# Altium schematic sheet InputBoard_Analog+Digital.SchDoc
size A4
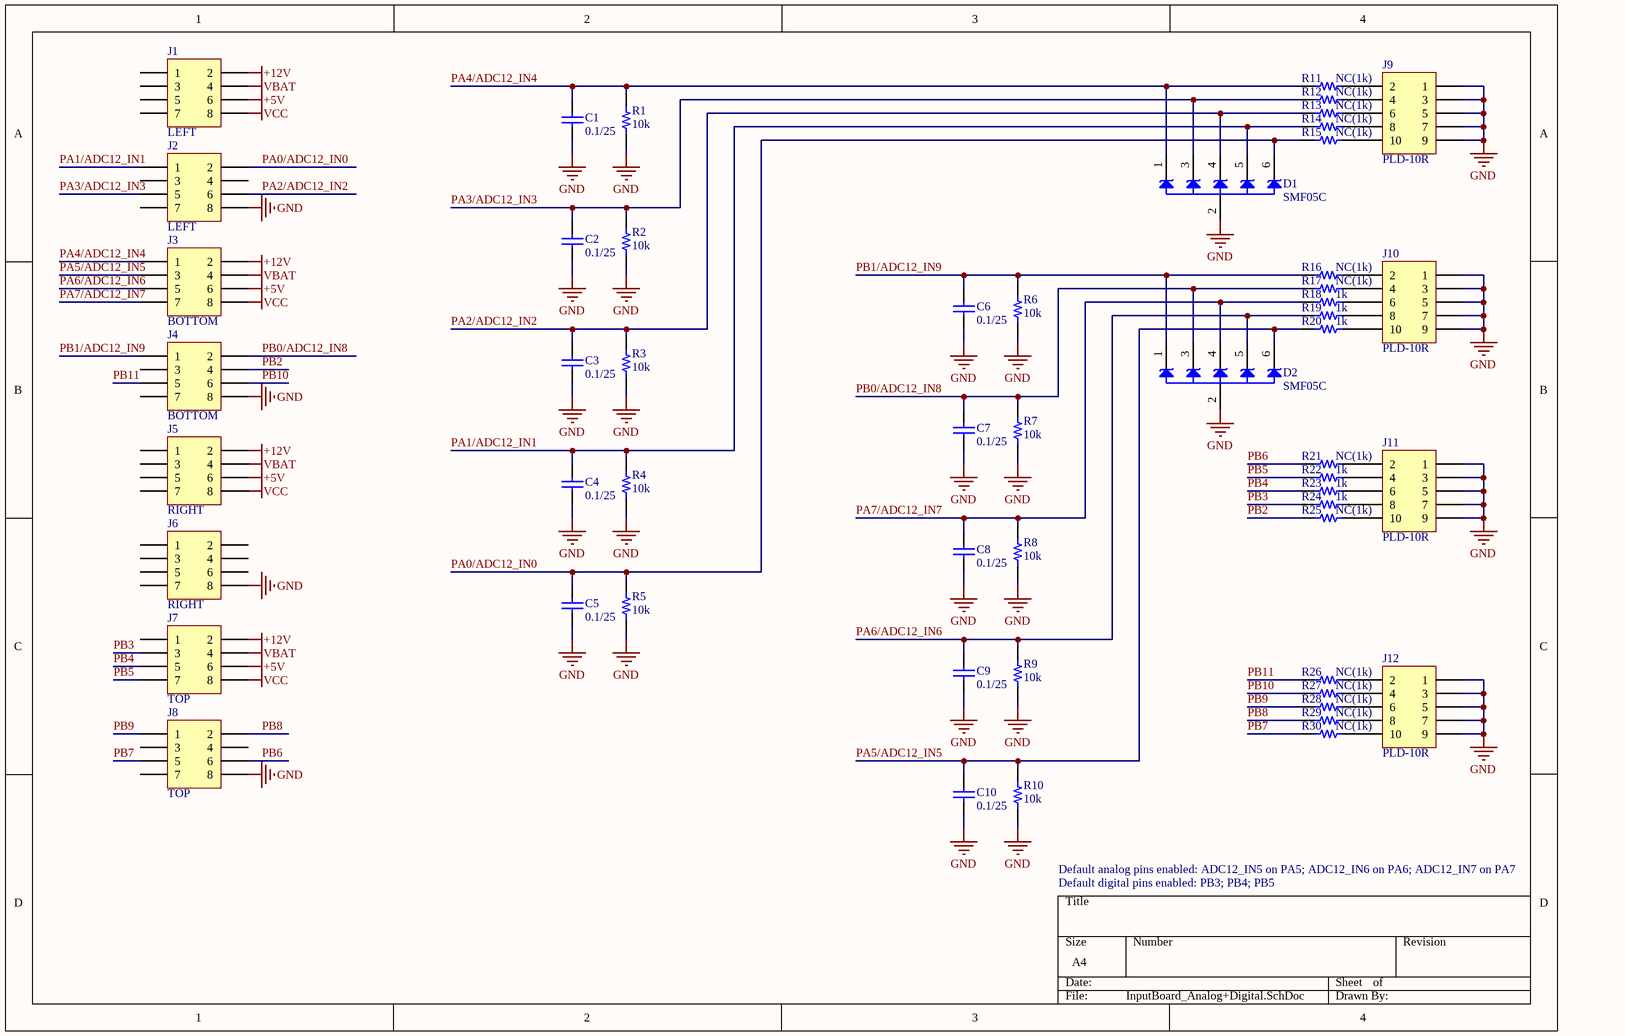
[diagram p0: InputBoard_Analog+Digital.SchDoc]

## Parts
C1  0.1/25  [CAP0402]
C2  0.1/25  [CAP0402]
C3  0.1/25  [CAP0402]
C4  0.1/25  [CAP0402]
C5  0.1/25  [CAP0402]
C6  0.1/25  [CAP0402]
C7  0.1/25  [CAP0402]
C8  0.1/25  [CAP0402]
C9  0.1/25  [CAP0402]
C10  0.1/25  [CAP0402]
D1  SMF05C  [SOT363]
D2  SMF05C  [SOT363]
J1  LEFT  [PBDM-8]
J2  LEFT  [PBDM-8]
J3  BOTTOM  [PBDM-8]
J4  BOTTOM  [PBDM-8]
J5  RIGHT  [PBDM-8]
J6  RIGHT  [PBDM-8]
J7  TOP  [PBDM-8]
J8  TOP  [PBDM-8]
J9  PLD-10R  [PLD-10R]
J10  PLD-10R  [PLD-10R]
J11  PLD-10R  [PLD-10R]
J12  PLD-10R  [PLD-10R]
R1  10k  [RES0402]
R2  10k  [RES0402]
R3  10k  [RES0402]
R4  10k  [RES0402]
R5  10k  [RES0402]
R6  10k  [RES0402]
R7  10k  [RES0402]
R8  10k  [RES0402]
R9  10k  [RES0402]
R10  10k  [RES0402]
R11  NC(1k)  [RES0402]
R12  NC(1k)  [RES0402]
R13  NC(1k)  [RES0402]
R14  NC(1k)  [RES0402]
R15  NC(1k)  [RES0402]
R16  NC(1k)  [RES0402]
R17  NC(1k)  [RES0402]
R18  1k  [RES0402]
R19  1k  [RES0402]
R20  1k  [RES0402]
R21  NC(1k)  [RES0402]
R22  1k  [RES0402]
R23  1k  [RES0402]
R24  1k  [RES0402]
R25  NC(1k)  [RES0402]
R26  NC(1k)  [RES0402]
R27  NC(1k)  [RES0402]
R28  NC(1k)  [RES0402]
R29  NC(1k)  [RES0402]
R30  NC(1k)  [RES0402]

## Nets
+5V: J1.6 J3.6 J5.6 J7.6
+12V: J1.2 J3.2 J5.2 J7.2
GND: C1.1 C2.1 C3.1 C4.1 C5.1 C6.1 C7.1 C8.1 C9.1 C10.1 D1.2 D2.2 J2.8 J4.8 J6.8 J8.8 J9.1 J9.3 J9.5 J9.7 J9.9 J10.1 J10.3 J10.5 J10.7 J10.9 J11.1 J11.3 J11.5 J11.7 J11.9 J12.1 J12.3 J12.5 J12.7 J12.9 R1.2 R2.2 R3.2 R4.2 R5.2 R6.2 R7.2 R8.2 R9.2 R10.2
VBAT: J1.4 J3.4 J5.4 J7.4
VCC: J1.8 J3.8 J5.8 J7.8
PA0/ADC12_IN0: C5.2 D1.6 J2.2 R5.1 R15.1
PA1/ADC12_IN1: C4.2 D1.5 J2.1 R4.1 R14.1
PA2/ADC12_IN2: C3.2 D1.4 J2.6 R3.1 R13.1
PA3/ADC12_IN3: C2.2 D1.3 J2.5 R2.1 R12.1
PA4/ADC12_IN4: C1.2 D1.1 J3.1 R1.1 R11.1
PA5/ADC12_IN5: C10.2 D2.6 J3.3 R10.1 R20.1
PA6/ADC12_IN6: C9.2 D2.5 J3.5 R9.1 R19.1
PA7/ADC12_IN7: C8.2 D2.4 J3.7 R8.1 R18.1
PB0/ADC12_IN8: C7.2 D2.3 J4.2 R7.1 R17.1
PB1/ADC12_IN9: C6.2 D2.1 J4.1 R6.1 R16.1
PB2: J4.4 R25.1
PB3: J7.3 R24.1
PB4: J7.5 R23.1
PB5: J7.7 R22.1
PB6: J8.6 R21.1
PB7: J8.5 R30.1
PB8: J8.2 R29.1
PB9: J8.1 R28.1
PB10: J4.6 R27.1
PB11: J4.5 R26.1
NetJ9_2: J9.2 R11.2
NetJ9_4: J9.4 R12.2
NetJ9_6: J9.6 R13.2
NetJ9_8: J9.8 R14.2
NetJ9_10: J9.10 R15.2
NetJ10_2: J10.2 R16.2
NetJ10_4: J10.4 R17.2
NetJ10_6: J10.6 R18.2
NetJ10_8: J10.8 R19.2
NetJ10_10: J10.10 R20.2
NetJ11_2: J11.2 R21.2
NetJ11_4: J11.4 R22.2
NetJ11_6: J11.6 R23.2
NetJ11_8: J11.8 R24.2
NetJ11_10: J11.10 R25.2
NetJ12_2: J12.2 R26.2
NetJ12_4: J12.4 R27.2
NetJ12_6: J12.6 R28.2
NetJ12_8: J12.8 R29.2
NetJ12_10: J12.10 R30.2

Not connected (* = marked no-connect by the designer): J1 1 3 5 7; J2 3 4 7; J4 3 7; J5 1 3 5 7; J6 1 2 3 4 5 6 7; J7 1; J8 3 4 7

## Notes on the sheet
- Default analog pins enabled: ADC12_IN5 on PA5; ADC12_IN6 on PA6; ADC12_IN7 on PA7
- Default digital pins enabled: PB3; PB4; PB5

## Library data of the parts
C1-C10 = CAP0402: Ceramic chip capacitor 0402; Value: 0.1; Voltage: 25; PartNumber: CAP0402; Category: Capacitor; Author: oiezhov
D1 D2 = SMF05C: 5-line TVS Array for ESD and Latch-Up Protection; WorkingVoltage: 5; PartNumber: SMF05C; Category: Transient Voltage Suppressor; ComponentLink1Description: Datasheet; ComponentLink1URL: d:\_AltiumLibs\Pdf\Discrete\TransientVoltageSuppressor\SMFxxC.PDF; Author: oiezhov
J1-J8 = PBDM-8: 2x4-pin header, pitch 2.54 mm; PartNumber: PBDM-8; Category: Connector; ComponentLink1Description: Datasheet; ComponentLink1URL: d:\_AltiumLibs\Pdf\Mechanical\Connector\pbsm.pdf; Author: oiezhov
J9-J12 = PLD-10R: 2x5-pin angle header, pitch 2.54 mm; PartNumber: PLD-10R; Category: Connector; ComponentLink1Description: Datasheet; ComponentLink1URL: d:\_AltiumLibs\Pdf\Mechanical\Connector\PLS, PLD.pdf; Author: oiezhov
R1-R30 = RES0402: Ceramic chip resistor; PartNumber: RES0402; Category: Resistor; Author: oiezhov
  R1-R10: Value: 10k
  R11-R17 R21 R25-R30: Value: NC(1k)
  R18-R20 R22-R24: Value: 1k